# EAGLE schematic plugV11-to-pcbway-4 (EAGLE 7.5.0)
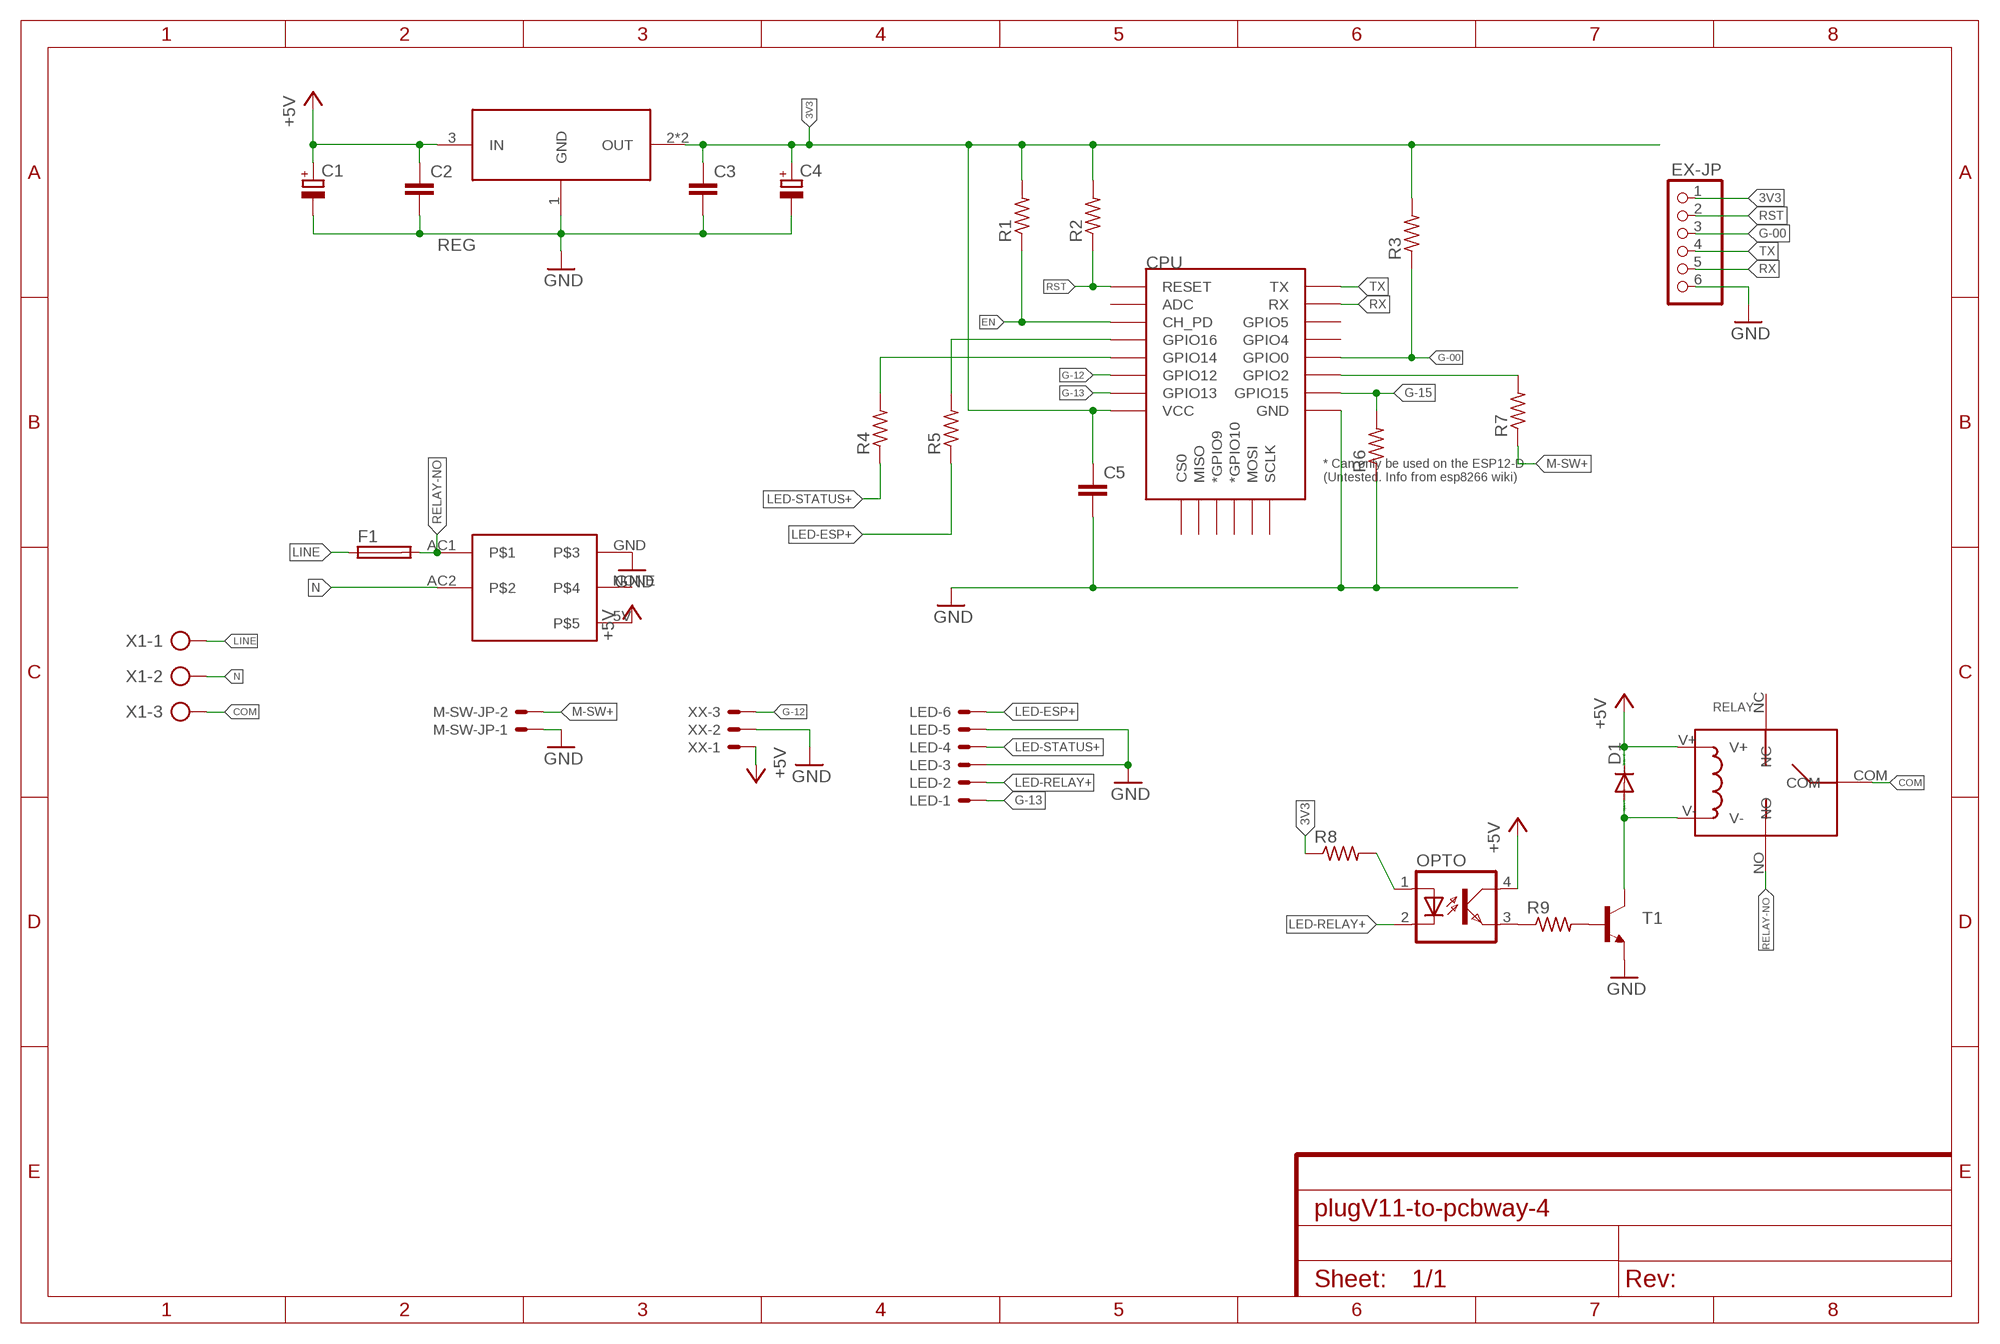
[diagram p0: schematic, sheet 1]

## Parts
C1  CPOL-EUB/3528-21R  [B/3528-21R]
C2  C-EUC0603K  [C0603K]
C3  C-EUC0603K  [C0603K]
C4  CPOL-EUB/3528-21R  [B/3528-21R]
C5  C-EUC0805  [C0805]
CPU  ESP12ESMD  [ESP12E-SMD]
D1  DIODE-DO-214AC  [DO-214AC]
EX-JP  PINHD-1X6  [1X06]
F1  FUSESH22,5  [SH22,5]
LED  53048-06  [53048-06]
M-SW-JP  53048-02  [53048-02]
OPTO  PC817  [DIL04]
R1  R-US_R0603  [R0603]
R2  R-US_R0603  [R0603]
R3  R-US_R0603  [R0603]
R4  R-US_R0603  [R0603]
R5  R-US_R0603  [R0603]
R6  R-US_R0603  [R0603]
R7  R-US_R0603  [R0603]
R8  R-US_M0805  [M0805]
R9  R-US_M0805  [M0805]
REG  AMS1117-3.3  [SOT-223]
RELAY  RELAY-SONGLE  [RELAY-SONGLE]
T1  BC817-NPN-SOT23-BEC  [SOT23-BEC]
U$4  POWERSUPPLY-5V-700MA  [POWERSUPPLY-5V-700MA]
X1  AK300/3  [AK300/3]
XX  53048-03  [53048-03]

## Nets
3V3: C3.1 C4.+ C5.1 CPU.VCC EX-JP.1 R1.2 R2.2 R3.2 R8.1 REG.2(OUT) REG.4(OUT)
+5V: C1.+ C2.1 D1.C OPTO.4(COL) REG.3(IN) RELAY.V+ U$4.5V XX.1
COM: RELAY.COM X1.3
EN: CPU.CH_PD R1.1
G-00: CPU.GPIO0 EX-JP.3 R3.1
G-12: CPU.GPIO12 XX.3
G-13: CPU.GPIO13 LED.1
G-15: CPU.GPIO15 R6.2
GND: C1.- C2.2 C3.2 C4.- C5.2 CPU.GND EX-JP.6 LED.3 LED.5 M-SW-JP.1 R6.1 REG.1(GND) T1.E U$4.GND XX.2
LED-ESP+: LED.6 R5.1
LED-RELAY+: LED.2 OPTO.2(C)
LED-STATUS+: LED.4 R4.1
LINE: F1.1 X1.1
M-SW+: M-SW-JP.2 R7.1
N: U$4.AC2 X1.2
N$1: OPTO.3(EMIT) R9.1
N$2: R9.2 T1.B
N$4: CPU.GPIO16 R5.2
N$7: CPU.GPIO2 R7.2
N$8: CPU.GPIO14 R4.2
N$13: OPTO.1(A) R8.2
N$18: D1.A RELAY.V- T1.C
RELAY-NO: F1.2 RELAY.NO U$4.AC1
RST: CPU.RESET EX-JP.2 R2.1
RX: CPU.RXD0(RX) EX-JP.5
TX: CPU.TXD0(TX) EX-JP.4
Unconnected: CPU.ADC CPU.CS0 CPU.GPIO4 CPU.GPIO5 CPU.GPIO9(*GPIO9) CPU.GPIO10(*GPIO10) CPU.MISO CPU.MOSI CPU.SCLK RELAY.NC U$4.NONE

## Library data of the parts
C1 C4 = rcl:CPOL-EU: POLARIZED CAPACITOR, European symbol
C2 C3 C5 = rcl:C-EU: CAPACITOR, European symbol
CPU = esp8266modules:ESP12E: ESP12E Module
D1 = diode:DIODE-: DIODE
EX-JP = pinhead:PINHD-1X6: PIN HEADER
F1 = fuse:FUSE: Fuse; OC_FARNELL: unknown; OC_NEWARK: unknown
LED = con-molex:53?-06: CONNECTOR wire to board 1.25 mm (.049 inch) pitch header; MF: WALDOM/MOLEX; MPN: 53048-0610; OC_FARNELL: 1012260; OC_NEWARK: 38C9911
M-SW-JP = con-molex:53?-02: CONNECTOR wire to board 1.25 mm (.049 inch) pitch header; MF: MOLEX; MPN: 53048-0210; OC_FARNELL: 1012259; OC_NEWARK: 57H4718
OPTO = optocoupler:PC817: SHARP OPTO COUPLER; MPN: PC817X4J000F; OC_FARNELL: 9707727; OC_NEWARK: 97K7059
R1-R9 = rcl:R-US_: RESISTOR, American symbol
REG = AMS1117-3.3:AMS1117-3.3: 1A LOW DROPOUT VOLTAGE REGULATOR
RELAY = Seeed-OPL-Relay:RELAY-SONGLE
T1 = transistor-neu-to92:*-NPN-: NPN Transistror
U$4 = PowerSupply-5V-700mA:POWERSUPPLY-5V-700MA
X1 = con-ptr500:AK300/3: CONNECTOR; OC_FARNELL: unknown; OC_NEWARK: unknown
XX = con-molex:53?-03: CONNECTOR wire to board 1.25 mm (.049 inch) pitch header; MF: WALDOM/MOLEX; MPN: 53048-0310; OC_FARNELL: 9732918; OC_NEWARK: 38C9908